# EAGLE design 2021-04-27 Coll-Interface (EAGLE 9.6.2)
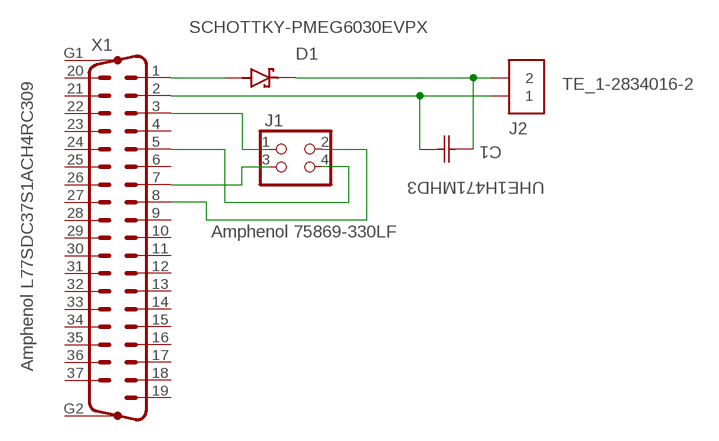
[diagram p0: schematic, sheet 1]

## Parts
C1  UHE1H471MHD3  ELECTROLYTIC_UHE1H471MHD3  [U1-EE_NCH]
D1  SCHOTTKY-PMEG6030EVPX  [DIO_PMEG6030EVPX]
J1  Amphenol 75869-330LF  PINHD-2X2AMP-75869-130LF  [2X02-SHROUD]
J2  TE_1-2834016-2  TERMINAL_BLOCK_2PIN_1-2834016-2  [TE_1-2834016-2]
X1  Amphenol L77SDC37S1ACH4RC309  M37HP  [M37HP]

## Nets
+24V-FROM-SPECMECH: D1.2(A) X1.1
+24V-TO-ROBOCLAW: C1.1 D1.1(K) J2.2.1 J2.2.2
GND-ROBOCLAW: C1.2 J2.1.1 J2.1.2 X1.2
GND-SPECMECH: J1.4 X1.5
ROBO-RX: J1.1 X1.3
ROBO-TX: J1.3 X1.7
VCC-SPECMECH: J1.2 X1.8
Unconnected: X1.4 X1.6 X1.9 X1.10 X1.11 X1.12 X1.13 X1.14 X1.15 X1.16 X1.17 X1.18 X1.19 X1.20 X1.21 X1.22 X1.23 X1.24 X1.25 X1.26 X1.27 X1.28 X1.29 X1.30 X1.31 X1.32 X1.33 X1.34 X1.35 X1.36 X1.37 X1.G1 X1.G2

## Library data of the parts
C1 = AUmlib:ELECTROLYTIC_UHE1H471MHD3; BUILT_BY: EMA_UL_Team; MANUFACTURER_PART_NUMBER: UHE1H471MHD3; SOURCELIBRARY: Nichicon_2014-12-31; VENDOR: Nichicon
D1 = AUmlib:SCHOTTKY-PMEG6030EVPX: PMEG6030 Series 60 V 3 A Surface Mount Schottky Barrier Rectifier - SOD-128; DESCRIPTION: Diode Schottky 60V 3A Surface Mount SOD-128/CFP5; DIGI-KEY_PART_NUMBER: 1727-1349-1-ND; MF: Nexperia USA; MP: PMEG6030EVPX; PACKAGE: CFP5-2 Nexperia USA Inc.; PURCHASE-URL: https://pricing.snapeda.com/search/part/PMEG6030EVPX/?ref=eda
J1 = AUmlib:PINHD-2X2: PIN HEADER
J2 = AUmlib:TERMINAL_BLOCK_2PIN_1-2834016-2: PCB Terminal Blocks, Receptacle, Wire-to-Board, 2 Positions, 1 Rows, Side Wire Entry Angle, 26 – 20AWG Wire Size, 6A Current Rating (Max), 300 VAC; COMMENT: 1-2834016-2; DESCRIPTION: Conn PC Terminal Block 2 POS 2.54mm Solder ST Thru-Hole 6A/Contact Box/Carton; DIGI-KEY_PART_NUMBER: A123829-ND; EU_ROHS_COMPLIANCE: Compliant; MF: TE Connectivity; MP: 1-2834016-2; PACKAGE: None; PURCHASE-URL: https://pricing.snapeda.com/search/part/1-2834016-2/?ref=eda
X1 = AUmlib:M37HP: SUB-D; OC_FARNELL: unknown; OC_NEWARK: unknown

## Board
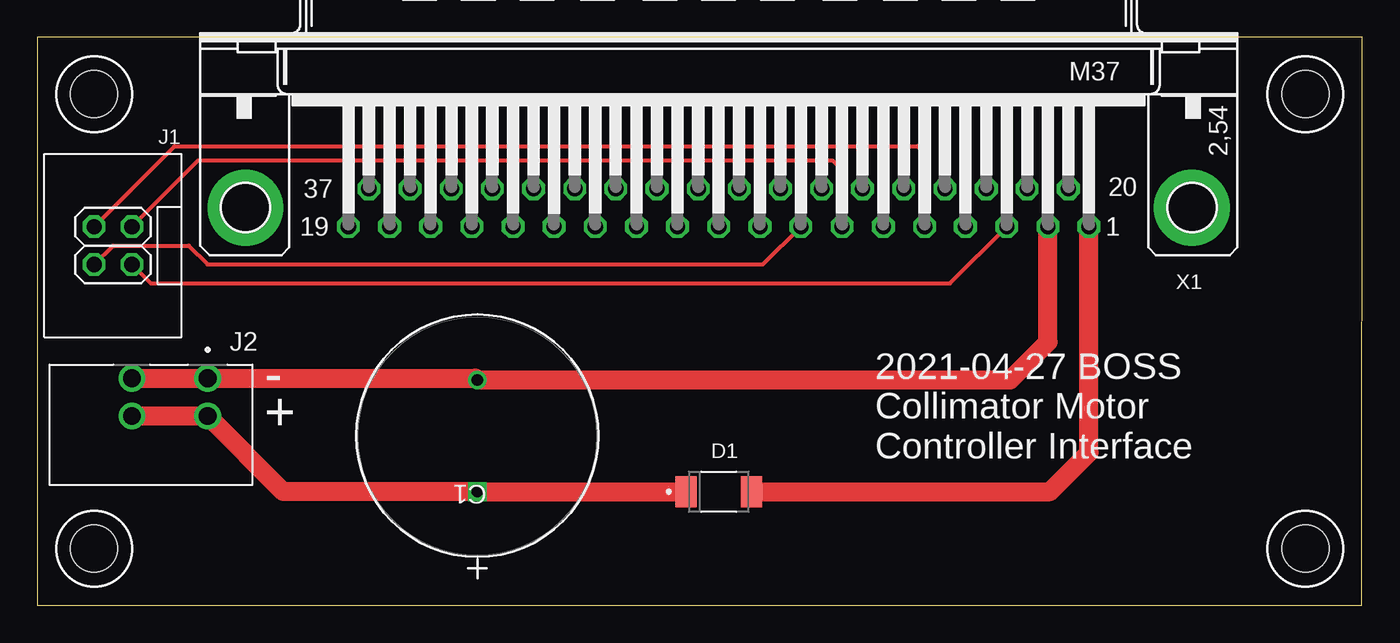
[diagram p1: board, top side]
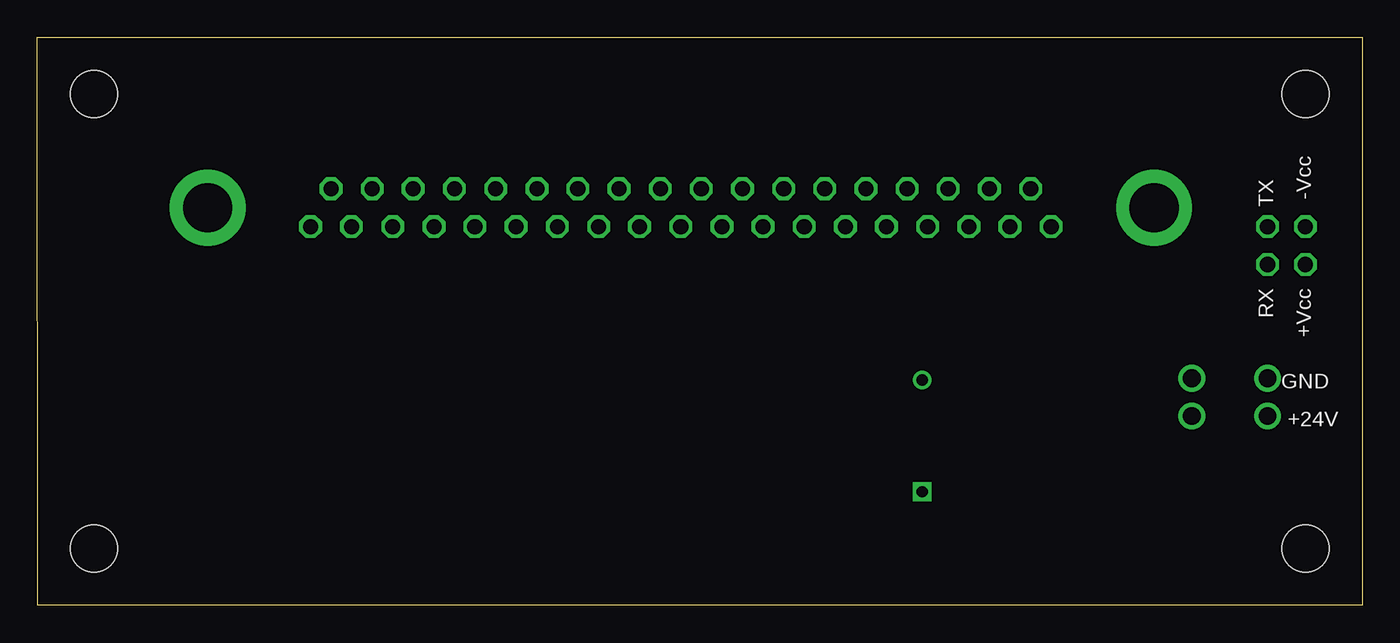
[diagram p2: board, bottom side, seen from below]

Size 88.9 x 38.1 mm. Coordinates in mm from the lower left corner, seen from the top.
Outline: 0,0 88.88,0 88.9,38.1 0,38.1 0,0
Copper layers (1*16): Top 0.035mm / dielectric 1.5mm / Bottom 0.035mm
Design rules "default": minimum track width 6mil, minimum drill 0.35mm, track to track 6mil, track to pad 6mil, pad to pad 6mil, via to via 6mil, smd to smd 6mil, copper to edge 40mil, drill to drill 6mil, minimum pad ring 10mil, minimum via ring 8mil, stop-mask expansion 4mil, vias tented up to drill 0mil, thermal gap 10mil
Holes 3.17 mm at 3.81,3.81 3.81,34.29 85.09,34.29 85.09,3.81

### Footprints (pad centres in the part's own frame; a part is rotated, then mirrored left to right if it is on the bottom)
U1-EE_NCH = drill 0.762 pad 1.27 square: 1 0,0 | drill 0.762 pad 1.27: 2 7.493,0
DIO_PMEG6030EVPX = smd 1.4 x 2.1: 1 -2.2,0; 2 2.2,0
2X02-SHROUD = drill 1.016 octagon: 1 -1.27,-1.27; 2 -1.27,1.27; 3 1.27,-1.27; 4 1.27,1.27
TE_1-2834016-2 = drill 1.2: 1.1 0,0; 1.2 0,-5.08; 2.1 2.54,0; 2.2 2.54,-5.08
M37HP = drill 1.016 octagon: 1 -24.841,1.27; 2 -22.098,1.27; 3 -19.329,1.27; 4 -16.561,1.27; 5 -13.818,1.27; 6 -11.049,1.27; 7 -8.28,1.27; 8 -5.512,1.27; 9 -2.769,1.27; 10 0,1.27; 11 2.769,1.27; 12 5.512,1.27; 13 8.28,1.27; 14 11.049,1.27; 15 13.792,1.27; 16 16.561,1.27; 17 19.329,1.27; 18 22.073,1.27; 19 24.841,1.27; 20 -23.47,-1.27; 21 -20.701,-1.27; 22 -17.958,-1.27; 23 -15.189,-1.27; 24 -12.421,-1.27; 25 -9.652,-1.27; 26 -6.909,-1.27; 27 -4.14,-1.27; 28 -1.372,-1.27; 29 1.372,-1.27; 30 4.14,-1.27; 31 6.909,-1.27; 32 9.652,-1.27; 33 12.421,-1.27; 34 15.189,-1.27; 35 17.932,-1.27; 36 20.701,-1.27; 37 23.47,-1.27 | drill 3.302 pad 5.08: G1 -31.75,0; G2 31.75,0

### Placement (x,y rotation side)
C1  29.53,7.62 90 top
D1  45.72,7.62 0 top
J1  5.08,24.13 90 top
J2  11.43,15.24 270 top
X1  45.72,26.67 180 top

### Tracks (layer width: path | path; a pad name or v marks a point on that pad's centre or on a via)
+24V-FROM-SPECMECH
  Top 1.27: D1.2 67.94,7.62 70.56,10.24 X1.1
+24V-TO-ROBOCLAW
  Top 1.27: J2.2.2 J2.2.1 16.51,7.62 C1.1 D1.1
GND-ROBOCLAW
  Top 1.27: J2.1.2 J2.1.1 29.4,15.24 C1.2 65.28,15.11 67.82,17.65 X1.2
GND-SPECMECH
  Top 0.254: J1.4 9.21,30.8 59.05,30.8 59.54,30.32 X1.5
ROBO-RX
  Top 0.254: J1.1 7.62,21.59 61.24,21.59 X1.3
ROBO-TX
  Top 0.254: J1.3 10.79,29.84 53.34,29.84 54,29.18 X1.7
VCC-SPECMECH
  Top 0.254: J1.2 5.08,24.13 10.16,24.13 11.43,22.86 48.69,22.86 X1.8

### Text on the board
tPlace: - | + | 2021-04-27 BOSS / Collimator Motor / Controller Interface
bPlace: -Vcc | TX | +Vcc | RX | GND | +24V